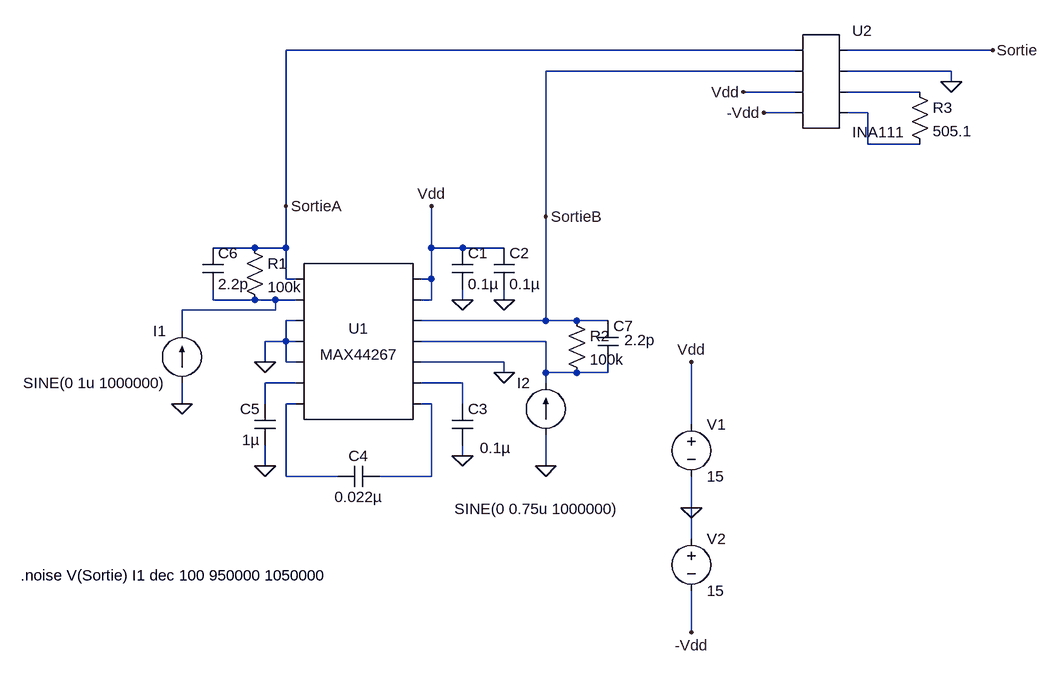
[diagram p0: schematic bruit simulation.asc]
bruit simulation.asc, the LTspice schematic file:
Version 4
SHEET 1 880 824
WIRE 256 -192 -528 -192
WIRE 560 -192 336 -192
WIRE 256 -160 -128 -160
WIRE 496 -160 336 -160
WIRE 496 -144 496 -160
WIRE 256 -128 176 -128
WIRE 448 -128 336 -128
WIRE 256 -96 208 -96
WIRE 368 -96 336 -96
WIRE 368 -48 368 -96
WIRE 448 -48 368 -48
WIRE -528 48 -528 -192
WIRE -128 64 -128 -160
WIRE -576 112 -640 112
WIRE -528 112 -528 48
WIRE -528 112 -576 112
WIRE -304 112 -304 48
WIRE -256 112 -304 112
WIRE -192 112 -256 112
WIRE -528 160 -528 112
WIRE -512 160 -528 160
WIRE -304 160 -304 112
WIRE -304 160 -320 160
WIRE -640 192 -640 176
WIRE -576 192 -640 192
WIRE -544 192 -576 192
WIRE -512 192 -544 192
WIRE -304 192 -304 160
WIRE -304 192 -320 192
WIRE -256 192 -256 176
WIRE -192 192 -192 176
WIRE -544 208 -544 192
WIRE -544 208 -688 208
WIRE -512 224 -528 224
WIRE -128 224 -128 64
WIRE -128 224 -320 224
WIRE -80 224 -128 224
WIRE -32 224 -80 224
WIRE -688 240 -688 208
WIRE -528 256 -528 224
WIRE -528 256 -560 256
WIRE -512 256 -528 256
WIRE -128 256 -320 256
WIRE -560 288 -560 256
WIRE -528 288 -528 256
WIRE -512 288 -528 288
WIRE -192 288 -320 288
WIRE -192 304 -192 288
WIRE -128 304 -128 256
WIRE -80 304 -128 304
WIRE -32 304 -32 288
WIRE -32 304 -80 304
WIRE -512 320 -560 320
WIRE -256 320 -320 320
WIRE -128 320 -128 304
WIRE -688 352 -688 320
WIRE -560 352 -560 320
WIRE -512 352 -528 352
WIRE -304 352 -320 352
WIRE -256 352 -256 320
WIRE 96 384 96 288
WIRE -256 432 -256 416
WIRE -560 448 -560 416
WIRE -128 448 -128 400
WIRE -528 464 -528 352
WIRE -448 464 -528 464
WIRE -304 464 -304 352
WIRE -304 464 -384 464
WIRE 96 512 96 464
WIRE 96 560 96 512
WIRE 96 704 96 640
FLAG -256 192 0
FLAG -192 192 0
FLAG -192 304 0
FLAG -256 432 0
FLAG -560 448 0
FLAG -560 288 0
FLAG -688 352 0
FLAG -528 48 SortieA
FLAG 96 288 Vdd
FLAG -304 48 Vdd
FLAG 96 704 -Vdd
FLAG 96 512 0
FLAG -128 448 0
FLAG -128 64 SortieB
FLAG 496 -144 0
FLAG 560 -192 Sortie
FLAG 176 -128 Vdd
FLAG 208 -96 -Vdd
SYMBOL AutoGenerated\\MAX44267 -416 256 R0
SYMATTR InstName U1
SYMBOL cap -272 112 R0
SYMATTR InstName C1
SYMATTR Value 0.1µ
SYMBOL cap -208 112 R0
SYMATTR InstName C2
SYMATTR Value 0.1µ
SYMBOL cap -272 352 R0
WINDOW 3 43 68 Left 2
SYMATTR Value 0.1µ
SYMATTR InstName C3
SYMBOL cap -384 448 R90
WINDOW 0 0 32 VBottom 2
WINDOW 3 32 32 VTop 2
SYMATTR InstName C4
SYMATTR Value 0.022µ
SYMBOL cap -544 416 R180
WINDOW 0 24 56 Left 2
WINDOW 3 24 8 Left 2
SYMATTR InstName C5
SYMATTR Value 1µ
SYMBOL res -592 96 R0
SYMATTR InstName R1
SYMATTR Value 100k
SYMBOL current -688 320 R180
WINDOW 0 24 80 Left 2
WINDOW 3 24 0 Left 2
WINDOW 123 0 0 Left 0
WINDOW 39 0 0 Left 0
SYMATTR InstName I1
SYMATTR Value SINE(0 1u 1000000)
SYMBOL voltage 96 368 R0
WINDOW 123 0 0 Left 0
WINDOW 39 0 0 Left 0
SYMATTR InstName V1
SYMATTR Value 15
SYMBOL voltage 96 544 R0
WINDOW 123 0 0 Left 0
WINDOW 39 0 0 Left 0
SYMATTR InstName V2
SYMATTR Value 15
SYMBOL current -128 400 R180
WINDOW 0 24 80 Left 2
WINDOW 3 -114 -114 Left 2
WINDOW 123 0 0 Left 0
WINDOW 39 0 0 Left 0
SYMATTR InstName I2
SYMATTR Value SINE(0 0.75u 1000000)
SYMBOL cap -48 224 R0
WINDOW 3 41 30 Left 2
SYMATTR Value 2.2p
SYMATTR InstName C7
SYMBOL res -96 208 R0
SYMATTR InstName R2
SYMATTR Value 100k
SYMBOL AutoGenerated\\INA111 288 -144 R0
SYMATTR InstName U2
SYMBOL res 432 -144 R0
SYMATTR InstName R3
SYMATTR Value 505.1
SYMBOL cap -656 112 R0
SYMATTR InstName C6
SYMATTR Value 2.2p
TEXT -936 616 Left 2 !.noise V(Sortie) I1 dec 100 950000 1050000

The netlist it stands for:
* bruit simulation.asc
* U1: MAX44267 (symbol AutoGenerated\MAX44267 not available, pins judged from their places): pin1=SortieA pin2=N003 pin3=0 pin4=0 pin5=0 pin6=N005 pin7=N007 pin8=Vdd pin9=Vdd pin10=SortieB pin11=N004 pin12=0 pin13=N006 pin14=N008
C1 Vdd 0 0.1µ
C2 Vdd 0 0.1µ
C3 N006 0 0.1µ
C4 N008 N007 0.022µ
C5 0 N005 1µ
R1 SortieA N003 100k
I1 0 N003 SINE(0 1u 1000000)
V1 Vdd 0 15
V2 0 -Vdd 15
I2 0 N004 SINE(0 0.75u 1000000)
C7 SortieB N004 2.2p
R2 SortieB N004 100k
* U2: INA111 (symbol AutoGenerated\INA111 not available, pins judged from their places): pin1=SortieA pin2=SortieB pin3=Vdd pin4=-Vdd pin5=Sortie pin6=0 pin7=N001 pin8=N002
R3 N001 N002 505.1
C6 SortieA N003 2.2p
.noise V(Sortie) I1 dec 100 950000 1050000
.backanno
.end